# Altium schematic sheet POWER.SchDoc
size A; SheetNumber: 3; SheetTotal: 3
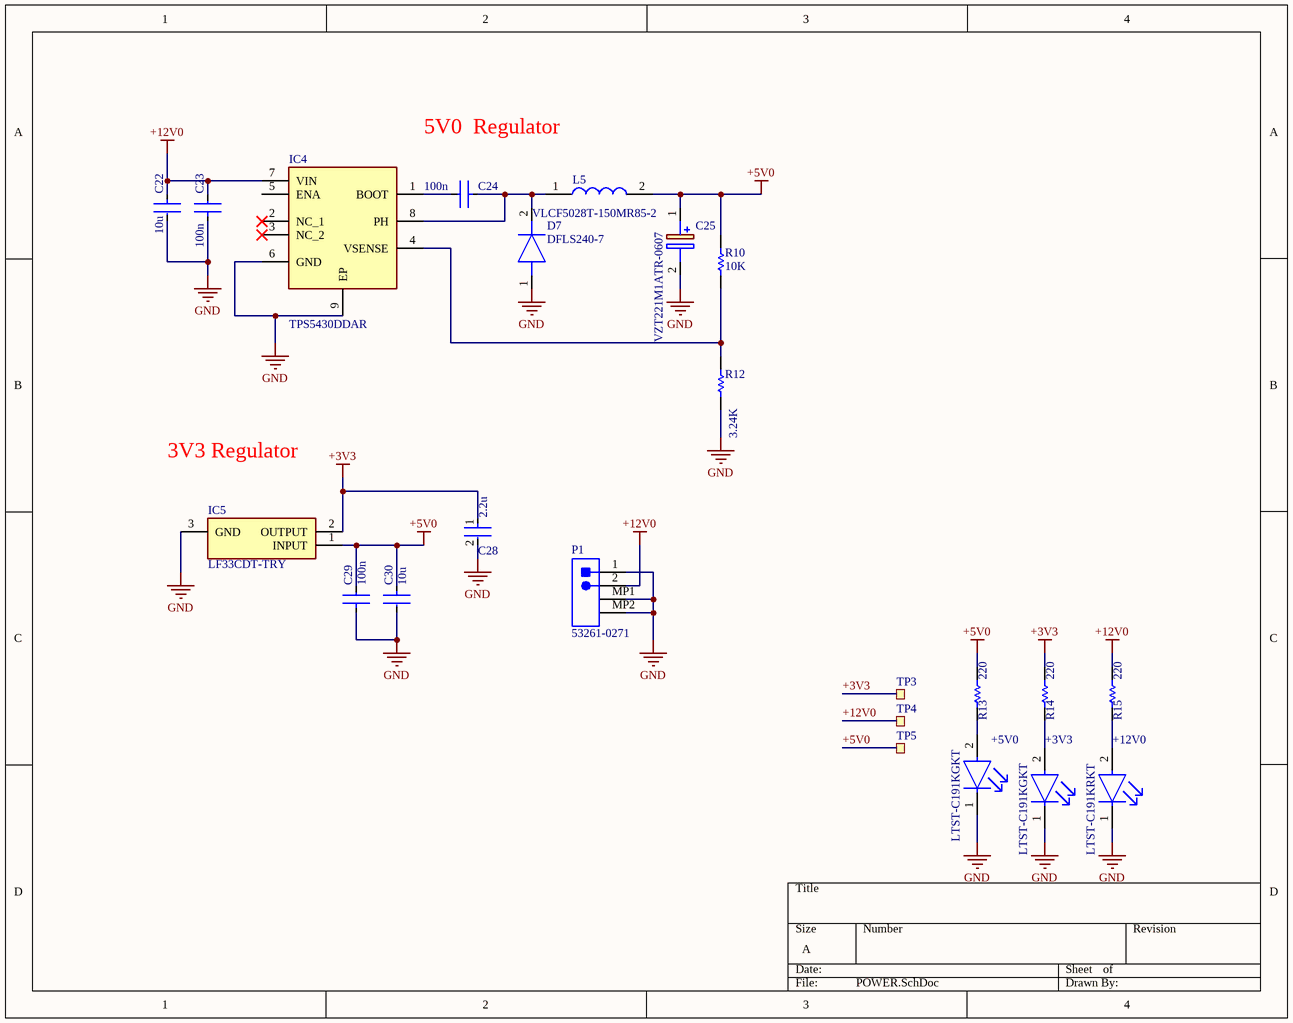
[diagram p0: POWER.SchDoc]

## Parts
+3V3  LTST-C191KGKT  [FP-LTST-C191KGKT-MFG]
+5V0  LTST-C191KGKT  [FP-LTST-C191KGKT-MFG]
+12V0  LTST-C191KRKT  [FP-LTST-C191KRKT-MFG]
C22  value 10u  [FP-C1608-080-IPC_A]  (hidden comment: C1608X5R1E106M080AC)
C23  value 100n  [FP-C1005-050-0_05-IPC_C]  (hidden comment: C1005X7R1H104K050BB)
C24  value 100n  [FP-C1005-050-0_05-IPC_C]  (hidden comment: C1005X7R1H104K050BB)
C25  VZT221M1ATR-0607  [CAPAE660X800N]
C28  Capacitance: 2.2u  [FP-C1005-050-0_15-IPC_A]  (hidden comment: C1005X5R1V225K050BC)
C29  value 100n  [FP-C1005-050-0_05-IPC_C]  (hidden comment: C1005X7R1H104K050BB)
C30  value 10u  [FP-C1608-080-IPC_A]  (hidden comment: C1608X5R1E106M080AC)
D7  DFLS240-7  [POWERDI123]
IC4  TPS5430DDAR  [SOIC127P600X170-9N]
IC5  LF33CDT-TRY  [LD1117DT33]
L5  VLCF5028T-150MR85-2  [VLCF5028]
P1  53261-0271  [MOLX-53261-0271_V]
R10  value 10K  [RESC1005X40X25LL05T10]  (hidden comment: RC0402FR-0710KL)
R12  value 3.24K  [RESC1005X40X25ML05T10]  (hidden comment: RC0402FR-073K24L)
R13  vlue: 220  [RESC1005X40X25ML05T10]  (hidden comment: RC0402FR-13220RL)
R14  vlue: 220  [RESC1005X40X25ML05T10]  (hidden comment: RC0402FR-13220RL)
R15  vlue: 220  [RESC1005X40X25ML05T10]  (hidden comment: RC0402FR-13220RL)
TP3  Ø1.5mm,SMD  [TP_SMD_Ø1.5mm]  (value not drawn)  (no BOM)
TP4  Ø1.5mm,SMD  [TP_SMD_Ø1.5mm]  (value not drawn)  (no BOM)
TP5  Ø1.5mm,SMD  [TP_SMD_Ø1.5mm]  (value not drawn)  (no BOM)

## Nets
+3V3: C28.1 IC5.2(OUTPUT) R14.2 TP3.1
+5V0: C25.1(+) C29.2 C30.1 IC5.1(INPUT) L5.2 R10.1 R13.2 TP5.1
+12V0: C22.1 C23.2 IC4.7(VIN) P1.2 R15.2 TP4.1
GND: +3V3.1(C) +5V0.1(C) +12V0.1(C) C22.2 C23.1 C25.2(-) C28.2 C29.1 C30.2 D7.1(A) IC4.6(GND) IC4.9(EP) IC5.3(GND) P1.1 P1.MP1 P1.MP2 R12.1
Net+3V3_2: +3V3.2(A) R14.1
Net+5V0_2: +5V0.2(A) R13.1
Net+12V0_2: +12V0.2(A) R15.1
NetC24_1: C24.1 D7.2(K) IC4.8(PH) L5.1
NetC24_2: C24.2 IC4.1(BOOT)
NetIC4_4: IC4.4(VSENSE) R10.2 R12.2

Not connected (* = marked no-connect by the designer): IC4 2(NC_1)* 3(NC_2)* 5(ENA)

## Notes on the sheet
- 5V0  Regulator
- 3V3 Regulator

## Library data of the parts
+3V3 +5V0 = CMP-2000-05198-4: NexarPartId: 549907; Forward Voltage: 2V; Viewing Angle: 130°; Lens Transparency: Clear; Power Rating: 75mW; Number of LEDs: 1; Luminous Intensity: 35mcd; Forward Current: 20mA; Dominant Wavelength: 571nm; Illumination Color: Green; Lens Color: Clear, Colorless; Reverse Voltage: 5V; Wavelength: 574nm; Number of Pins: 2; Packaging: Tape and Reel; Number of Elements: 1; Schedule B: 8541402000, 8541402000; Height: 550µm; Case/Package: 0603; Depth: 800µm; Max Operating Temperature: 85°C; RoHS: Compliant; Lens Style: Clear; Lead Free: Lead Free; Length: 1.6mm; Mount: Surface Mount; Test Current: 20mA; Width: 800µm; Case Code (Imperial): 0603; Min Operating Temperature: -55°C; Case Code (Metric): 1608; Radiation Hardening: No; Power Dissipation: 75mW; Color: Green
+12V0 = CMP-2000-05199-2: NexarPartId: 549908; Illumination Color: Red; Lens Transparency: Clear; Luminous Intensity: 54mcd; Current: 2A; Forward Current: 20mA; Number of Elements: 1; Power Rating: 75mW; Lens Color: Colorless; Wavelength: 639nm; Viewing Angle: 130°; Voltage: 2V; Dominant Wavelength: 631nm; Reverse Voltage: 5V; Height: 550µm; Length: 1.6mm; Number of Pins: 2; Packaging: Tape and Reel; Mount: Surface Mount; Case Code (Metric): 1608; Radiation Hardening: No; Case Code (Imperial): 0603; Test Current: 20mA; Number of LEDs: 1; Schedule B: 8541402000, 8541402000; Lead Free: Lead Free; Power Dissipation: 75mW; RoHS: Compliant; Forward Voltage: 2V; Lens Style: Clear; Color: Red; Max Operating Temperature: 85°C; Depth: 800µm; Width: 800µm; Min Operating Temperature: -55°C; Case/Package: 0603
C22 C30 = CMP-2000-05442-2: CAP CER 10UF 25V X5R 0603; Dielectric Material: Ceramic; Tolerance: 20%; Dielectric: X5R; Length: 1.6mm; Termination: SMD/SMT; Depth: 0.8mm; RoHS Compliant: Yes; Construction: Flat; Weight: 7.1E-05oz; Thickness: 0.039inch; Packaging: Tape and Reel; Min Operating Temperature: -55°C; Case Code (Imperial): 0603; Case/Package: 0603; Height: 0.8mm; Case Code (Metric): 1608; Voltage Rating: 25V; Resistor Type: Ceramic; Voltage Rating (DC): 25V; Max Operating Temperature: 85°C; REACH SVHC: No SVHC; Lead Free: Lead Free; Series: C; Width: 0.8mm; Mount: Surface Mount; Package Quantity: 1; Capacitance: 10uF
C23 C24 C29 = CMP-2000-05393-2: Multilayer Ceramic Capacitors 100nF ±10% 50V X7R SMD 0402; Voltage: 50V; Dielectric Material: Ceramic; Min Operating Temperature: -55°C; Depth: 0.5mm; Radiation Hardening: No; RoHS Compliant: Yes; Voltage Rating (DC): 50V; Lead Free: Lead Free; Resistor Type: Ceramic; Height: 0.5mm; Dielectric: X7R; Thickness: 0.022inch; Case/Package: 0402; Case Code (Metric): 1005; Termination: SMD/SMT; Capacitance: 100nF; Packaging: Tape and Reel; Max Operating Temperature: 125°C; Mount: Surface Mount; Package Quantity: 1; Width: 0.02inch; Weight: 2.3E-05oz; Voltage Rating: 50V; Tolerance: 10%; Construction: Flat; Case Code (Imperial): 0402; Length: 1mm; REACH SVHC: No SVHC; Series: C
C25 = VZT221M1ATR-0607: Capacitor Polarised; Manufacturer_Name: Lelon; Datasheet Link: http://www.lelon.com/upload/prod/173631643921.pdf; Height: 8mm; Manufacturer_Part_Number: VZT221M1ATR-0607; Mouser Part Number: 140-VZT221M1ATR-0607; Mouser Price/Stock: https://www.mouser.co.uk/ProductDetail/Lelon/VZT221M1ATR-0607?qs=wd5RIQLrsJgJ%252BgwNNtmauQ%3D%3D
C28 = CMP-08246-007153-1: CAP CER 2.2UF 35V X5R 0402; Dielectric Material: Ceramic; Tolerance: 10%; Package Quantity: 1; Voltage Rating: 35V; Case Code (Metric): 1005; Width: 0.5mm; RoHS Compliant: Yes; Min Operating Temperature: -55°C; Packaging: Tape and Reel; Voltage Rating (DC): 35V; Thickness: 0.022inch; REACH SVHC: No SVHC; Max Operating Temperature: 85°C; Length: 1mm; Case Code (Imperial): 0402; Resistor Type: Ceramic; Lead Free: Lead Free; Series: C; Termination: SMD/SMT; Height: 0.5mm; Mount: Surface Mount; Case/Package: 0402; Weight: 2.3E-05oz; Dielectric: X5R; Depth: 0.5mm
D7 = DFLS240-7: Diode; Manufacturer_Name: Diodes Incorporated; Datasheet Link: https://www.diodes.com//assets/Datasheets/DFLS240.pdf; Manufacturer_Part_Number: DFLS240-7; Mouser Part Number: 621-DFLS240-7; Mouser Price/Stock: https://www.mouser.co.uk/ProductDetail/Diodes-Incorporated/DFLS240-7?qs=mQbszxtPdlOdicBjJF8M2A%3D%3D; Arrow Part Number: DFLS240-7; Arrow Price/Stock: https://www.arrow.com/en/products/dfls240-7/diodes-incorporated?utm_currency=USD&region=europe
IC4 = TPS5430DDAR: Integrated Circuit; Manufacturer_Name: Texas Instruments; Datasheet Link: http://www.ti.com/lit/gpn/tps5430; Height: 1.7mm; Manufacturer_Part_Number: TPS5430DDAR; Mouser Part Number: 595-TPS5430DDAR; Mouser Price/Stock: https://www.mouser.co.uk/ProductDetail/Texas-Instruments/TPS5430DDAR?qs=zwk82MlA57ZJdOTovH1aYA%3D%3D; Arrow Part Number: TPS5430DDAR; Arrow Price/Stock: https://www.arrow.com/en/products/tps5430ddar/texas-instruments?region=nac
IC5 = LF33CDT-TRY: Integrated Circuit; Manufacturer_Name: STMicroelectronics; Datasheet Link: https://www.st.com/resource/en/datasheet/lfxx.pdf; Height: 2mm; Manufacturer_Part_Number: LF33CDT-TRY; Mouser Part Number: 511-LF33CDT-TRY; Mouser Price/Stock: https://www.mouser.co.uk/ProductDetail/STMicroelectronics/LF33CDT-TRY?qs=fnYUjNMxfVBCqlsIwZoKRw%3D%3D; Arrow Part Number: LF33CDT-TRY; Arrow Price/Stock: https://www.arrow.com/en/products/lf33cdt-try/stmicroelectronics?region=nac
L5 = VLCF5028T-150MR85-2: Inductor; Manufacturer_Name: TDK; Datasheet Link: https://product.tdk.com/system/files/dam/doc/product/inductor/inductor/smd/catalog/inductor_commercial_power_vlcf5028-2_en.pdf; Manufacturer_Part_Number: VLCF5028T-150MR85-2; Mouser Part Number: 810-VLCF528T150MR852; Mouser Price/Stock: https://www.mouser.co.uk/ProductDetail/TDK/VLCF5028T-150MR85-2?qs=uxmvvYJjMIszC3VRfNbrqA%3D%3D; Arrow Part Number: VLCF5028T-150MR85-2; Arrow Price/Stock: https://www.arrow.com/en/products/vlcf5028t-150mr85-2/tdk?region=nac
P1 = CMP-2000-05633-1: PicoBlade(TM) Header, Right Angle, -40 to 85 degC, 2-Pin SMD, RoHS, Tape and Reel; Current - Max: 1A; Brand: Molex; Voltage Rating: 125V; Number of Positions: 2; Pitch: 1.25mm; Package Version: Rev. H, 11/2014; Factory Pack Quantity: 1000; Datasheet URL: http://www.molex.com/webdocs/datasheets/pdf/en-us/0532610271_PCB_HEADERS.pdf; Datasheet Version: 03/2016; Housing Material: Thermoplastic; RoHS: Details; Product Type: Headers; Number of Rows: 1; Termination Style: SMD; Mounting Technology: SurfaceMount; Number of Positions / Contacts: 2; Package URL: http://www.molex.com/pdm_docs/sd/532610271_sd.pdf; Mounting Angle: Right; Mounting Style: SMD/SMT; Manufacturer: Molex; Product Category: 1.25mmConnectors; Tradename: PicoBlade; Voltage - Max: 125V; Manufacturer URL: http://www.molex.com/; Series: 53261; Package Description: 2-Leads Header, Pitch 1.25 mm, Mated Height 3.4 mm; Package Reference: 53261-0271; Current Rating: 1A; Contact Plating: Tin; Contact Material: PhosphorBronze; Type: Shrouded; Packaging: Reel
R10 = CMP-2002-07353-1: Manufacturer: Yageo / Phycomp; Part Number: RC0402FR-0710KL
R12 = CMP-2002-07650-1: Manufacturer: Yageo; Part Number: RC0402FR-073K24L
R13-R15 = CMP-2002-07866-1: Manufacturer: Yageo; Part Number: RC0402FR-13220RL
TP3-TP5 = TP_SMD_Ø1.5MM: 1.5mm circular SMD testpad; Manufacturer: Nordic Semiconductor; Manufacturer Part Number: N.A.; Pad Count: 1; Part Number: TP_SMD_Ø1.5MM; LatestRevisionDate: 2016-06-02; Published: 2016-06-02; Value: Ø1.5mm,SMD; Note: N.A.; Artikkelnr Noca: N.A.; Footprint Doc: TP_SMD_Ø1.5mm; Part number IPS: N.A.; ComponentLink1URL: N.A.; ComponentLink1Description: Datasheet; ComponentLink2URL: N.A.; ComponentLink2Description: Supplier link; HelpURL: N.A.; Supplier 1: N.A.; Supplier Part Number 1: N.A.; Supplier 2: N.A.; Supplier Part Number 2: N.A.; Component Class: Connectors; PartId: 100500477